# Altium schematic sheet MCU.SchDoc
size A; SheetNumber: 2; SheetTotal: 2
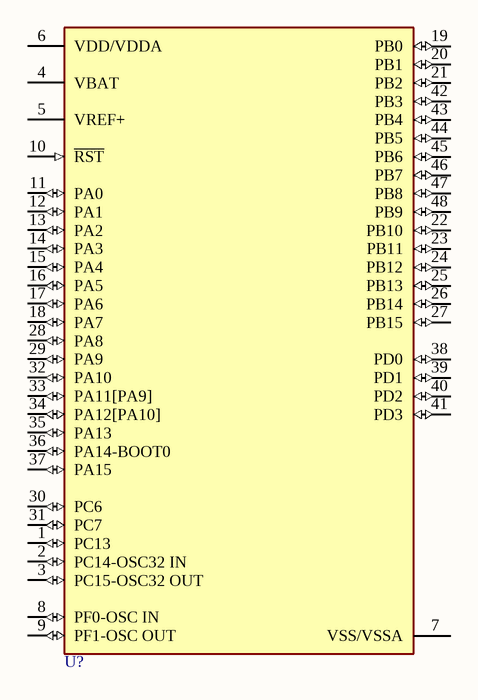
[diagram p0: MCU.SchDoc]

## Parts
U?  STM32G030C8T6  [STMicroelectronics_LQFP48-5B_IPC_A]  (value not drawn)

## Nets

Not connected (* = marked no-connect by the designer): U? 1(PC13) 2(PC14-OSC32_IN) 3(PC15-OSC32_OUT) 4(VBAT) 5(VREF+) 6(VDD/VDDA) 7(VSS/VSSA) 8(PF0-OSC_IN) 9(PF1-OSC_OUT) 10(~{RST}) 11(PA0) 12(PA1) 13(PA2) 14(PA3) 15(PA4) 16(PA5) 17(PA6) 18(PA7) 19(PB0) 20(PB1) 21(PB2) 22(PB10) 23(PB11) 24(PB12) 25(PB13) 26(PB14) 27(PB15) 28(PA8) 29(PA9) 30(PC6) 31(PC7) 32(PA10) 33(PA11[PA9]) 34(PA12[PA10]) 35(PA13) 36(PA14-BOOT0) 37(PA15) 38(PD0) 39(PD1) 40(PD2) 41(PD3) 42(PB3) 43(PB4) 44(PB5) 45(PB6) 46(PB7) 47(PB8) 48(PB9)